# EasyEDA Pro project ProProject_单路无刷驱动版 BLDC_2023-12-23.epro, board 无刷V3.0_3-PCB1_5
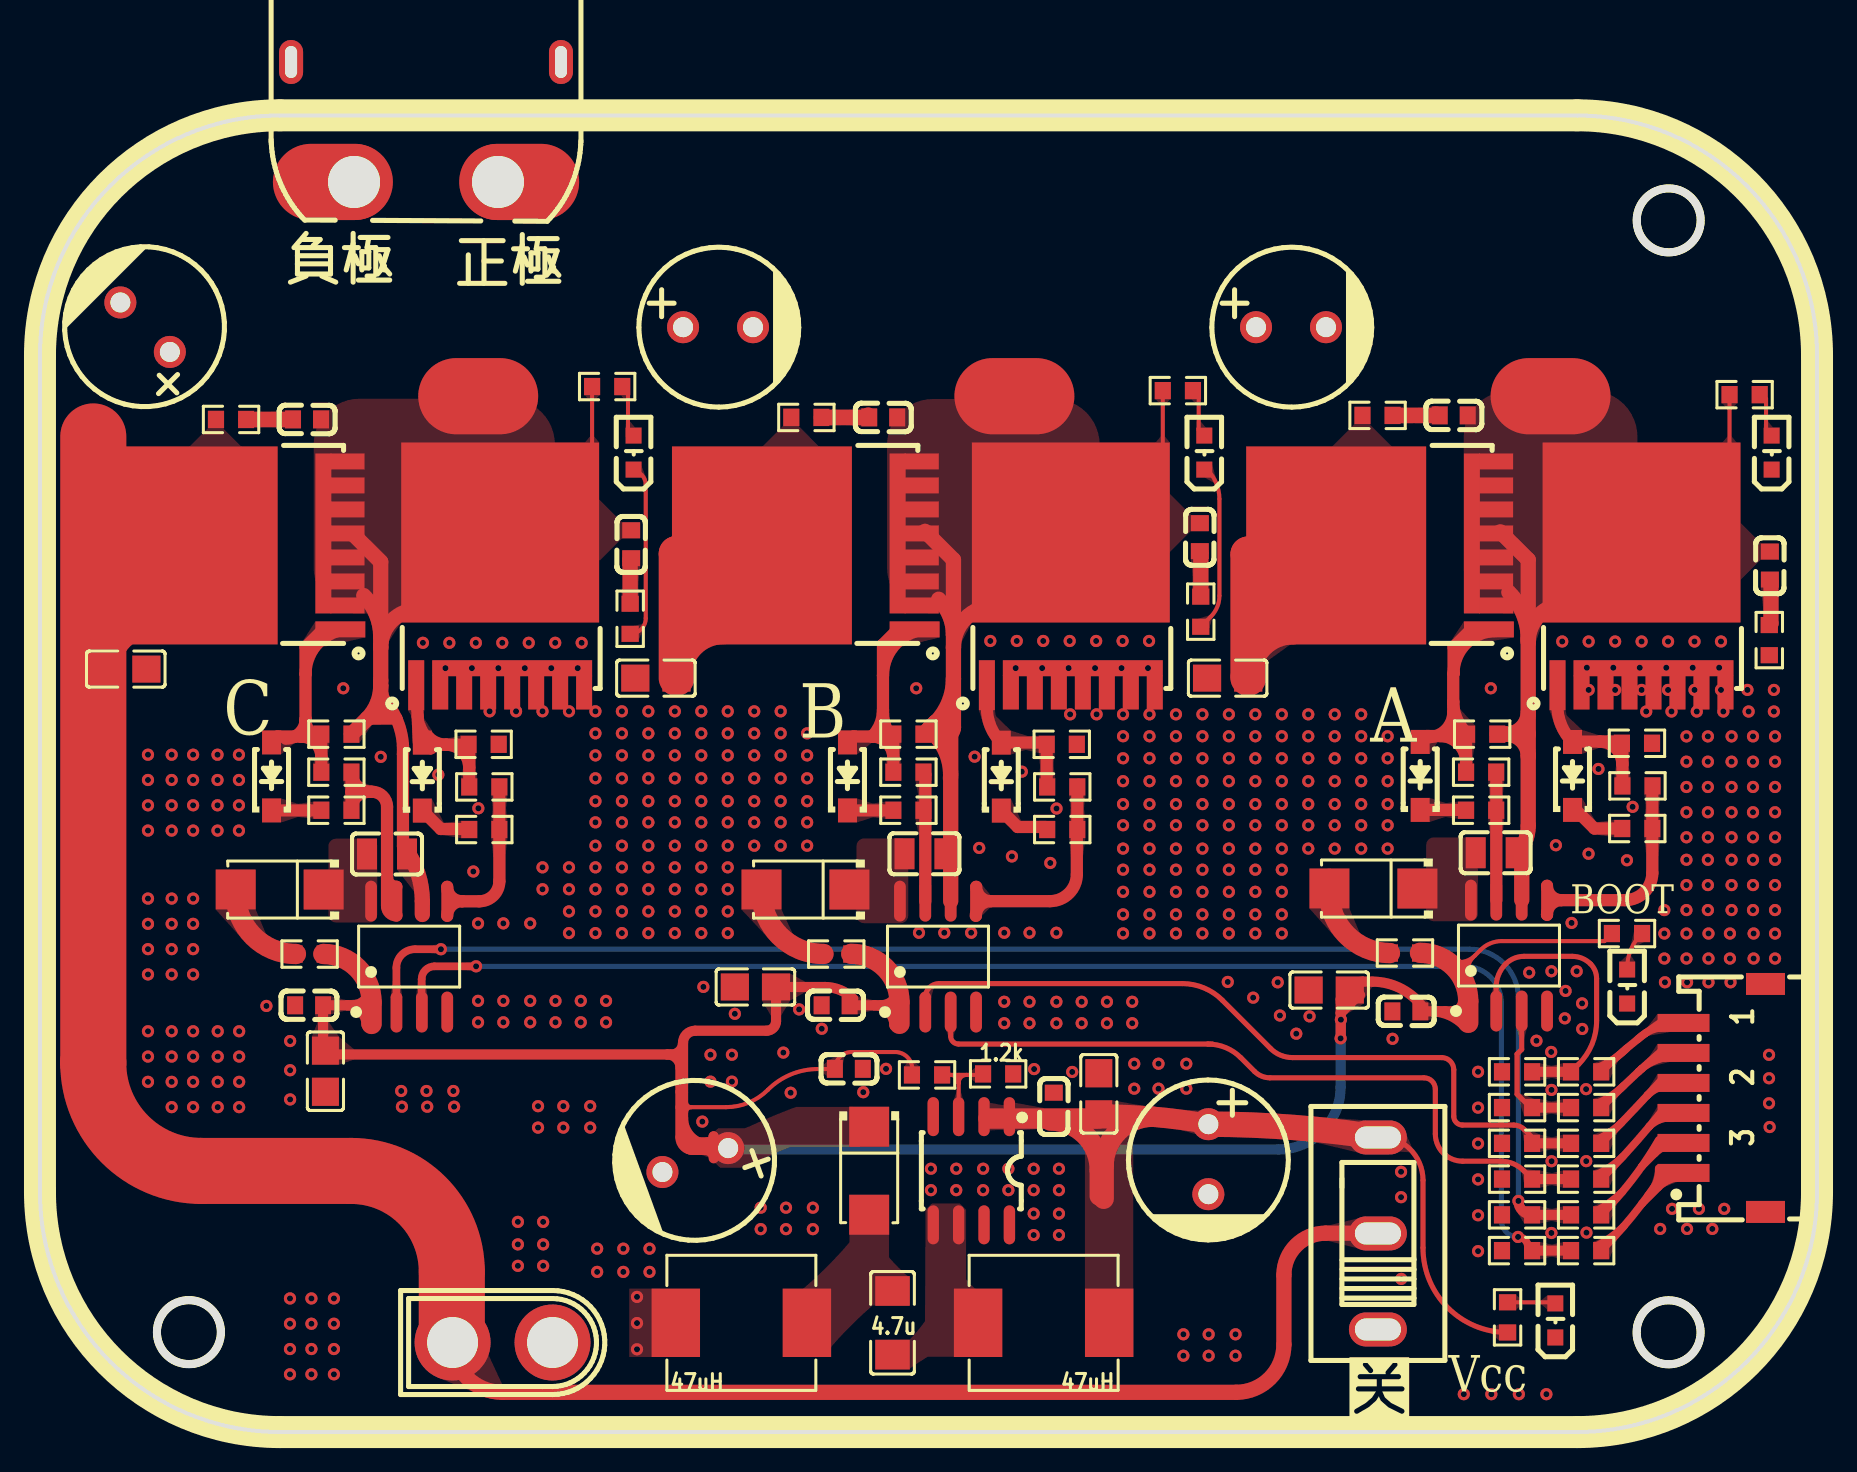
[diagram p2: board, top side]
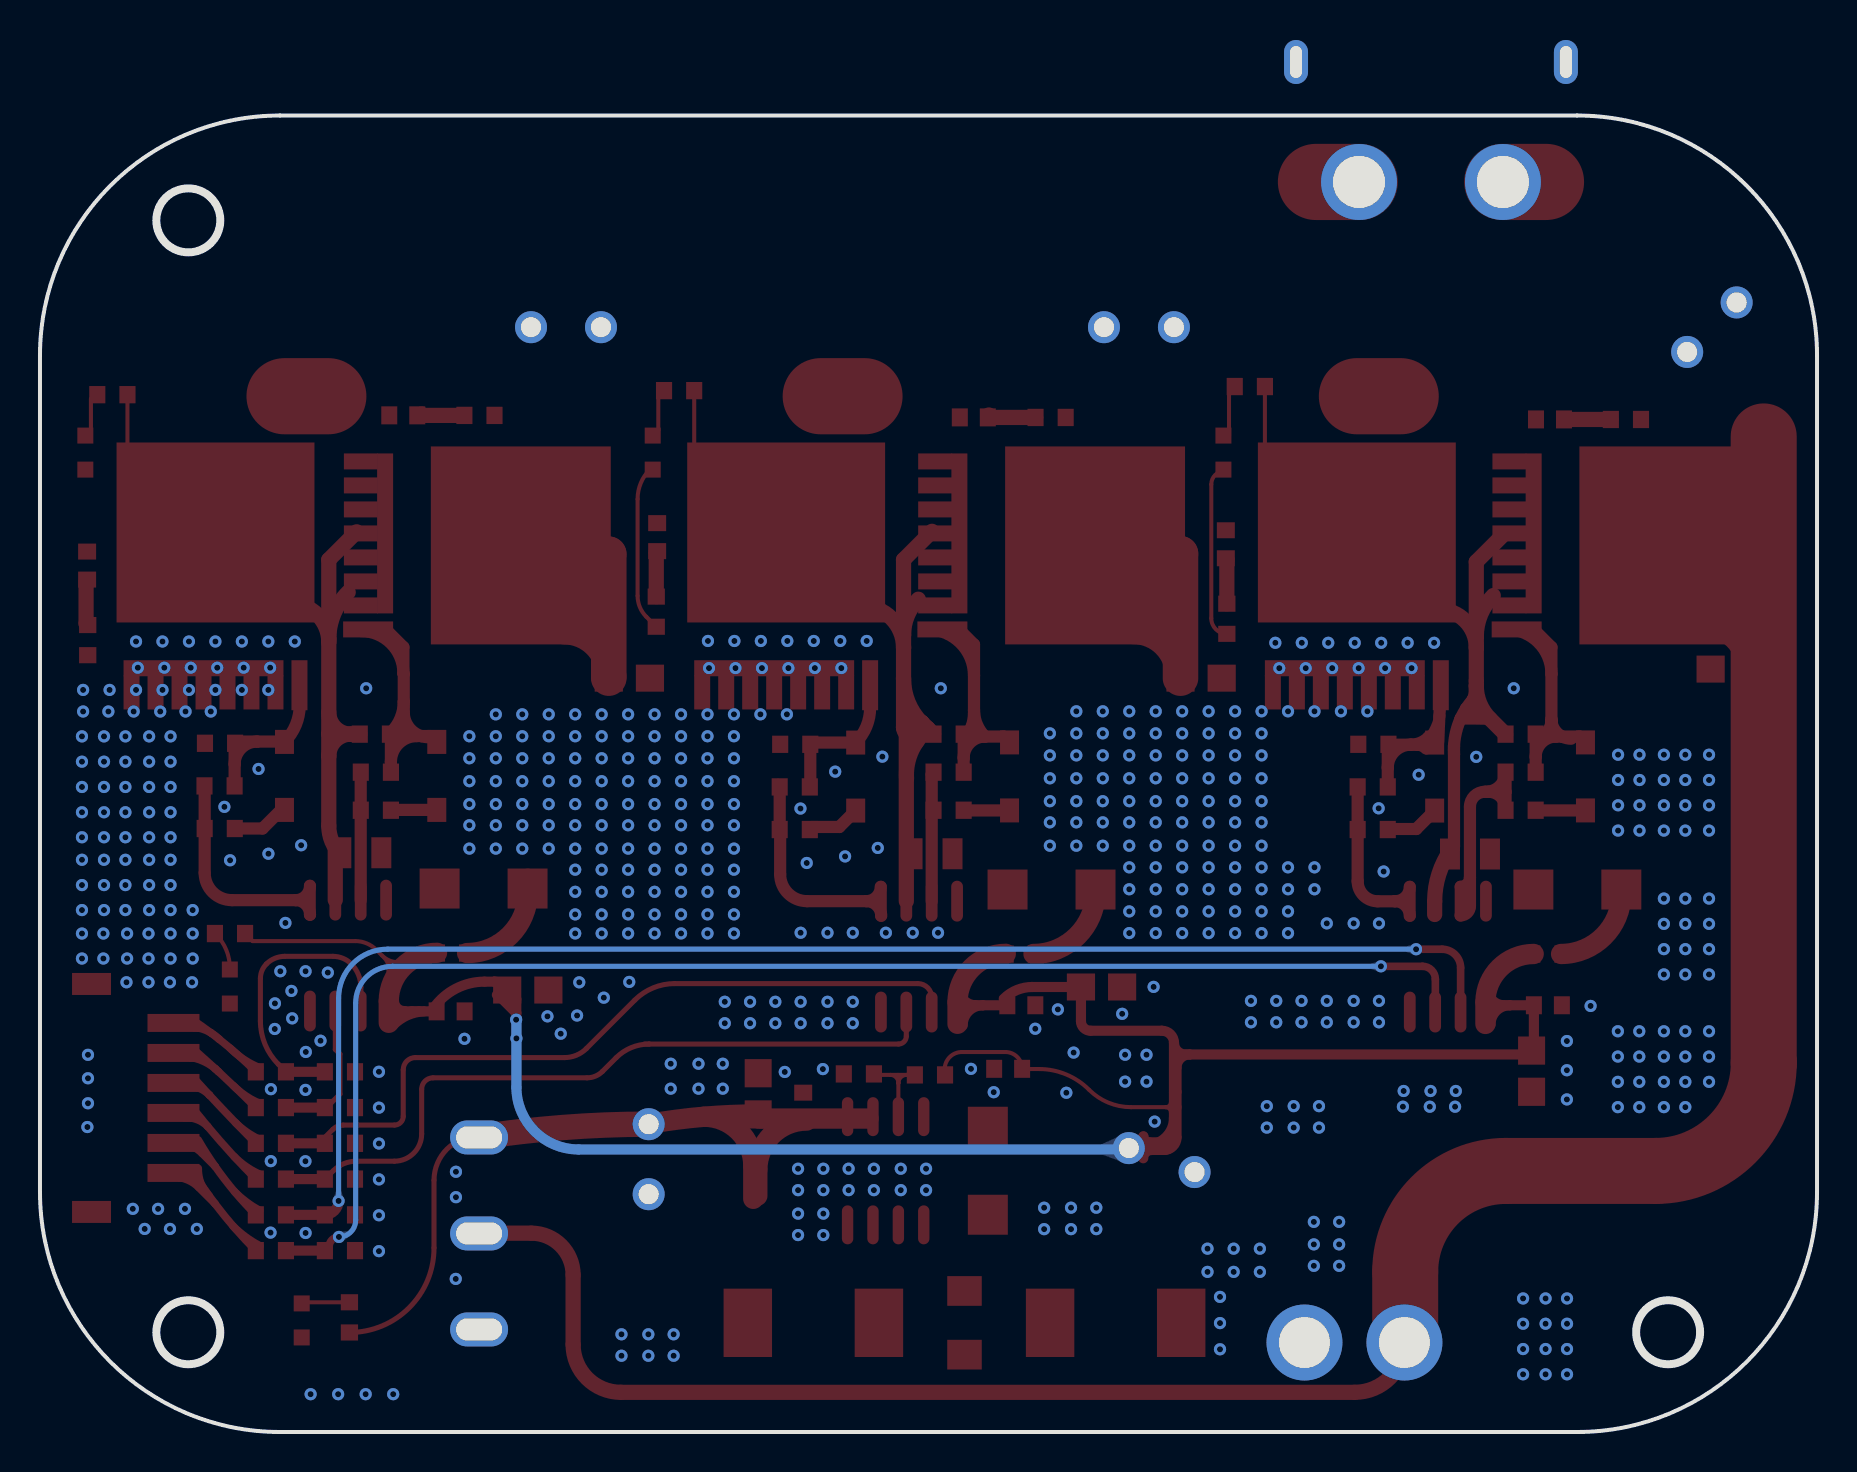
[diagram p3: board, bottom side, seen from below]

Outline 88.89 x 65.83 mm; copper layers: Top Layer, Bottom Layer. Coordinates in mm from the lower left corner of the outline.
Outline path: circle c7.45,4.99 r1.6 ; circle c81.48,60.58 r1.6 ; circle c81.48,4.99 r1.6 ; 0,53.83 0,12 arc(3.51,3.51) 12,0 76.89,0 arc(85.38,3.51) 88.89,12 88.89,53.83 arc(85.38,62.31) 76.89,65.83 12,65.83 arc(3.51,62.31) 0,53.83
Stack: Top Layer 0.035mm / Dielectric1 1.51mm FR4 er 4.5 / Bottom Layer 0.035mm

## Design rules (mm)
template: 用户自定义配置
spacing safeClearance (default): track to track 0.152, other pairs 0.152 to 0.3
track width trackWidth (default): min 0.127, default 0.254, max 4
differential pair differentialPair (default): width min 0.127, default 0.254, max 2.54; gap min 0.152, default 0.152
via viaSize (default): diameter min 0.5, default 0.61, max 10; hole min 0.3, default 0.305, max 5.999
pour e292 uses 8mil
pour e1048 uses 地-发散自适应8
pour e1738 uses copperRegion1
pour e6104 uses copperRegion1

## Placement (name value [footprint] x y rotation side)
C4  220uF  [CAP-TH_BD8.0-P3.50-D0.6-FD]  33.92 55.24 0 top
C5  220uF  [CAP-TH_BD8.0-P3.50-D0.6-FD]  5.26 55.24 135 top
C6  220uF  [CAP-TH_BD8.0-P3.50-D0.6-FD]  62.58 55.24 0 top
C8  2.2uF  [C0805]  30.81 37.7 0 top
C10  1uF  [C0805#2]  73.82 28.96 180 top
C11  10uF  [C0805]  64.49 22.1 0 top
C12  100nF  [C0603_1]  68.35 21.03 0 top
C14  220uF  [CAP-TH_BD8.0-P3.50-D0.6-FD]  58.45 13.64 270 top
C15  22uF  [C0805]  52.97 16.91 270 top
C16  1uF  [C0603]  50.71 16.27 270 top
C17  4.7uF  [C1206]  42.65 5.46 90 top
C18  220uF  [CAP-TH_BD8.0-P3.50-D0.6-FD]  32.78 13.6 200 top
C19  100nF  [C0603_1]  40.46 18.16 180 top
C20  2.2uF  [C0805]  59.41 37.7 0 top
C22  1uF  [C0805#2]  45.25 28.91 180 top
C23  10uF  [C0805]  35.79 22.25 0 top
C25  100nF  [C0603_1]  39.8 21.34 0 top
C27  2.2uF  [C0805]  4.29 38.15 180 top
C29  1uF  [C0805#2]  18.36 28.9 180 top
C39  10uF  [C0805]  14.28 18.04 90 top
C40  100nF  [C0603_1]  13.46 21.34 0 top
C47  2.2nF  [C0603]  70.72 50.84 180 top
C48  2.2nF  [C0603]  86.54 43.32 90 top
C49  2.2nF  [C0603]  42.18 50.73 180 top
C50  2.2nF  [C0603]  58.02 44.75 90 top
C51  2.2nF  [C0603]  13.36 50.63 180 top
C52  2.2nF  [C0603]  29.57 44.39 90 top
CN3  KH-ZH1.5WF-06A  [CONN-SMD_KH-ZH1.5WF-06A]  84.27 16.7 90 top
CN4  XT30U-M  [CONN-TH_XT30U-M]  23.14 4.47 0 top
CN5  XT60PW-M  [CONN-TH_XT60PW-M]  19.31 65.5 270 top
D1  B5819W SL  [SOD-123_L2.7-W1.6-LS3.7-RD-1]  69.05 32.81 90 top
D5  SS210  [SMA_L4.3-W2.6-LS5.2-RD]  66.7 27.18 180 top
D6  B5819W SL  [SOD-123_L2.7-W1.6-LS3.7-RD-1]  76.66 32.81 90 top
D8  B5819W SL  [SOD-123_L2.7-W1.6-LS3.7-RD-1]  40.39 32.78 90 top
D10  SS210  [SMA_L4.3-W2.6-LS5.2-RD]  38.29 27.12 180 top
D11  B5819W SL  [SOD-123_L2.7-W1.6-LS3.7-RD-1]  48.09 32.77 90 top
D13  B5819W SL  [SOD-123_L2.7-W1.6-LS3.7-RD-1]  11.58 32.78 90 top
D15  SS210  [SMA_L4.3-W2.6-LS5.2-RD]  11.99 27.12 180 top
D16  B5819W SL  [SOD-123_L2.7-W1.6-LS3.7-RD-1]  19.13 32.77 90 top
D18  SS210  [SMA_L4.3-W2.6-LS5.2-RD]  41.48 13.06 270 top
L1  47uH  [IND-SMD_L7.3-W6.6]  50.21 5.46 0 top
L2  47uH  [IND-SMD_L7.3-W6.6]  35.09 5.46 180 top
LED2  KT-0603R  [LED0603-R-RD]  79.4 22.28 90 top
LED4  KT-0603R  [LED0603-R-RD]  75.8 5.58 90 top
LED5  KT-0603R  [LED0603-R-RD]  86.63 48.97 90 top
LED6  KT-0603R  [LED0603-R-RD]  58.24 48.97 90 top
LED7  KT-0603R  [LED0603-R-RD]  29.69 48.97 90 top
NOREF  -  [Pad_e2409]  14.65 62.51 90 top
NOREF#2  -  [Pad_e2408]  23.97 62.51 90 top
NOREF#3  -  [Pad_e56]  48.74 51.79 270 top
NOREF#4  -  [Pad_e62]  21.92 51.79 90 top
NOREF#5  -  [Pad_e61]  75.57 51.79 90 top
Q1  HYG011N04LS1TA  [PG-HSOF-8_L10.4-W9.9-P1.2-LS11.7-TL-1]  68.84 44.33 180 top
Q2  HYG011N04LS1TA  [PG-HSOF-8_L10.4-W9.9-P1.2-LS11.7-TL-1]  80.11 40.98 90 top
Q3  HYG011N04LS1TA  [PG-HSOF-8_L10.4-W9.9-P1.2-LS11.7-TL-1]  40.11 44.33 180 top
Q4  HYG011N04LS1TA  [PG-HSOF-8_L10.4-W9.9-P1.2-LS11.7-TL-1]  51.57 40.98 90 top
Q5  HYG011N04LS1TA  [PG-HSOF-8_L10.4-W9.9-P1.2-LS11.7-TL-1]  11.39 44.33 180 top
Q6  HYG011N04LS1TA  [PG-HSOF-8_L10.4-W9.9-P1.2-LS11.7-TL-1]  23.02 40.98 90 top
R1  4.7Ω  [R0603]  72.09 31.09 180 top
R2  0603WAF220KT5E  [R0603]  66.91 50.83 180 top
R4  0603WAF100JT5E  [R0603]  72.09 32.99 180 top
R5  0603WAF220KT5E  [R0603]  68.28 23.95 180 top
R6  10kΩ  [R0603]  72.14 34.89 180 top
R7  100Ω  [R0603]  77.34 18.01 180 top
R8  4.7Ω  [R0603]  79.9 30.18 180 top
R9  0603WAF100JT5E  [R0603]  79.91 32.31 180 top
R10  10kΩ  [R0603]  79.89 34.44 180 top
R11  100Ω  [R0603]  77.34 16.22 180 top
R12  100Ω  [R0603]  77.34 14.43 180 top
R13  100Ω  [R0603]  77.34 12.65 180 top
R14  100Ω  [R0603]  77.34 10.86 180 top
R15  100Ω  [R0603]  77.34 9.07 180 top
R16  10kΩ  [R0603]  73.89 18.01 0 top
R17  10kΩ  [R0603]  73.89 16.22 0 top
R18  0603WAF220KT5E  [R0603]  86.51 39.6 90 top
R19  4.7Ω  [R0603]  43.44 31.09 180 top
R20  10kΩ  [R0603]  73.89 14.43 0 top
R21  10kΩ  [R0603]  73.89 12.65 0 top
R22  10kΩ  [R0603]  73.89 10.86 0 top
R23  10kΩ  [R0603]  73.89 9.07 0 top
R24  0603WAF220KT5E  [R0603]  38.34 50.73 180 top
R26  0603WAF1201T5E  [R0603]  47.93 17.91 180 top
R27  10k  [R0603]  79.39 24.92 0 top
R28  0603WAF100JT5E  [R0603]  43.44 32.99 180 top
R29  0603WAF220KT5E  [R0603]  39.83 23.9 180 top
R30  10k  [R0603]  44.37 17.86 0 top
R31  10kΩ  [R0603]  43.44 34.89 180 top
R32  4.7Ω  [R0603]  51.14 30.13 180 top
R33  0603WAF100JT5E  [R0603]  51.14 32.26 180 top
R34  10kΩ  [R0603]  51.11 34.39 180 top
R36  0603WAF220KT5E  [R0603]  58.07 41.02 90 top
R37  4.7Ω  [R0603]  14.83 31.09 180 top
R38  0603WAF220KT5E  [R0603]  9.56 50.63 180 top
R39  0603WAF100JT5E  [R0603]  14.83 32.99 180 top
R40  0603WAF220KT5E  [R0603]  13.49 23.9 180 top
R41  10kΩ  [R0603]  14.83 34.89 180 top
R42  4.7Ω  [R0603]  22.23 30.13 180 top
R43  0603WAF100JT5E  [R0603]  22.23 32.26 180 top
R44  10k  [R0603]  73.42 5.73 270 top
R45  10k  [R0603]  85.27 51.87 180 top
R46  10kΩ  [R0603]  22.19 34.39 180 top
R47  10k  [R0603]  56.92 52.07 180 top
R48  0603WAF220KT5E  [R0603]  29.52 40.66 90 top
R49  10k  [R0603]  28.37 52.28 180 top
SW1  SS12D10G4 071  [SW-TH_SHOU-HAN_SS12D10G4]  66.93 9.93 90 top
U2  XL6007E1  [SOIC-8_L5.0-W4.0-P1.27-LS6.0-BL]  46.59 13.06 180 top
U7  EG3112  [SOIC-8_L4.9-W3.9-P1.27-LS6.0-BL]  73.49 23.82 0 top
U10  EG3112  [SOIC-8_L4.9-W3.9-P1.27-LS6.0-BL]  44.92 23.77 0 top
U11  EG3112  [SOIC-8_L4.9-W3.9-P1.27-LS6.0-BL]  18.47 23.77 0 top

## Footprints (pads in the part's own frame, mm; a bottom-side part is the same pattern mirrored in y, then rotated)
C0603
  rect 0.8x0.9 smd: 1(-0.7,0) 2(0.7,0)
C0603_1
  rect 0.8x0.9 smd: 1(-0.7,0) 2(0.7,0)
C0805
  rect 1.409x1.351 smd: 1(-1.028,0) 2(1.031,0)
C0805#2
  rect 1x1.55 smd: 1(0,0) 2(2,0)
C1206
  rect 1.485x1.728 smd: 1(-1.593,0) 2(1.593,0)
CAP-TH_BD8.0-P3.50-D0.6-FD
  round 1.6 hole 1: 1(-1.75,0) 2(1.75,0)
CONN-SMD_KH-ZH1.5WF-06A
  rect 0.9x2.6 smd: 1(-3.75,2.05) 2(-2.25,2.05) 3(-0.75,2.05) 4(0.75,2.05) 5(2.25,2.05) 6(3.75,2.05)
  rect 1.1x1.95 smd: 7(5.7,-2.05) 8(-5.7,-2.05)
CONN-TH_XT30U-M
  round 3.8 hole 2.54: 1(-2.5,0) 2(2.5,0)
CONN-TH_XT60PW-M
  round 3.8 hole 2.6: 1(3,-3.6) 2(3,3.6)
  oval 2.2x1.2 hole 1.6x0.6: 3(-3,6.75) 4(-3,-6.75)
IND-SMD_L7.3-W6.6
  rect 2.423x3.419 smd: 1(3.279,0) 2(-3.279,0)
LED0603-R-RD
  rect 0.8x0.8 smd: 1(0.851,0) 2(-0.851,0)
Pad_e56
  oval 3.81x6 smd: 1(0,0)
Pad_e61
  oval 3.81x6 smd: 2(0,0)
Pad_e62
  oval 3.81x6 smd: 3(0,0)
Pad_e2408
  oval 3.81x6 smd: 3(0,0)
Pad_e2409
  oval 3.81x6 smd: 3(0,0)
PG-HSOF-8_L10.4-W9.9-P1.2-LS11.7-TL-1
  rect 2.5x0.8 smd: 1(-3.638,4.2)
  rect 1.7x0.8 smd: 2(-4,3) 3(-4,1.8) 4(-4,0.6) 5(-4,-0.6) 6(-4,-1.8) 7(-4,-3) 8(-4,-4.2)
  rect 0.8x8 smd: 8(-2.788,-0.6)
  rect 9x9.9 smd: 9(4,0)
R0603
  rect 0.807x0.864 smd: 1(-0.754,0) 2(0.754,0)
SMA_L4.3-W2.6-LS5.2-RD
  rect 2x2 smd: 1(-2.2,0) 2(2.2,0)
SOD-123_L2.7-W1.6-LS3.7-RD-1
  rect 1.2x0.95 smd: 1(-1.7,0) 2(1.7,0)
SOIC-8_L4.9-W3.9-P1.27-LS6.0-BL
  oval 0.588x2.045 smd: 1(-1.905,-2.772) 2(-0.635,-2.772) 3(0.635,-2.772) 4(1.905,-2.772) 5(1.905,2.772) 6(0.635,2.772) 7(-0.635,2.772) 8(-1.905,2.772)
SOIC-8_L5.0-W4.0-P1.27-LS6.0-BL
  oval 0.569x1.95 smd: 1(-1.905,-2.705) 2(-0.635,-2.705) 3(0.635,-2.705) 4(1.905,-2.705) 5(1.905,2.705) 6(0.635,2.705) 7(-0.635,2.705) 8(-1.905,2.705)
SW-TH_SHOU-HAN_SS12D10G4
  oval 1.7x2.9 hole 1.1x2.3: 1(-4.8,0) 2(0,0) 3(4.8,0)

## Nets
As in the schematic, except:
GND: C4.2 C5.2 C6.2 C8.1 C11.1 C12.1 C14.2 C15.1 C16.1 C18.2 C19.1 C20.1 C23.1 C25.1 C27.1 C39.1 C40.1 CN3.7 CN3.8 CN4.2 CN5.1 L2.1 LED2.2 LED4.2 LED5.2 LED6.2 LED7.2 NOREF.3 Q2.2 Q2.3 Q2.4 Q2.5 Q2.6 Q2.7 Q2.8 Q4.2 Q4.3 Q4.4 Q4.5 Q4.6 Q4.7 Q4.8 Q6.2 Q6.3 Q6.4 Q6.5 Q6.6 Q6.7 Q6.8 R10.1 R16.1 R17.1 R18.1 R20.1 R21.1 R22.1 R23.1 R26.1 R34.1 R36.1 R46.1 R48.1 U2.7 U2.8 U7.4 U10.4 U11.4
VCC: C14.1 C15.2 C16.2 L1.1 R44.2 SW1.3 U2.1 U2.2
BAT: C4.1 C5.1 C6.1 C8.2 C20.2 C27.2 CN4.1 CN5.2 NOREF#2.3 Q1.9 Q3.9 Q5.9 R2.2 R24.2 R38.2 SW1.2
OUT1: C10.1 C47.1 C48.2 NOREF#5.2 Q1.2 Q1.3 Q1.4 Q1.5 Q1.6 Q1.7 Q1.8 Q2.9 R6.1 R45.2 U7.6
OUT2: C22.1 C49.1 C50.2 NOREF#3.1 Q3.2 Q3.3 Q3.4 Q3.5 Q3.6 Q3.7 Q3.8 Q4.9 R31.1 R47.2 U10.6
OUT3: C29.1 C51.1 C52.2 NOREF#4.3 Q5.2 Q5.3 Q5.4 Q5.5 Q5.6 Q5.7 Q5.8 Q6.9 R41.1 R49.2 U11.6
$2N2328: D11.2 Q4.1 R33.2 R34.2
$2N2329: D8.2 Q3.1 R28.2 R31.2
$2N2348: D16.2 Q6.1 R43.2 R46.2
$2N2349: D13.2 Q5.1 R39.2 R41.2

Pads without a net: CN5 3 4; SW1 1; U2 4

## Via types
v1: diameter 0.61, hole 0.305, Top Layer to Bottom Layer, 558 vias

## Routing (per net, layer and track width the routed paths; a pad name or vN(x,y) marks a point on that pad's centre or on a via; arc(x,y) is an arc through that point)
GND: length 17.3
  Top Layer w0.203: R36.1 58.57,40.77 arc(58.89,41.25) 59,41.81 59,46.65 arc(58.84,47.45) 58.39,48.13 ; 29.63,48.06 arc(30.1,47.86) 30.3,47.38 30.3,40.69 arc(30.07,40.14) R48.1
  vias: v1(5.4,33.87) v1(5.4,32.6) v1(5.4,31.34) v1(5.4,30.07) v1(5.4,26.67) v1(5.4,25.41) v1(5.4,24.14) v1(5.4,22.88) v1(5.4,20.04) v1(5.4,18.77) v1(5.4,17.51) v1(6.59,33.87) v1(6.59,32.6) v1(6.59,31.34) v1(6.59,30.07) v1(6.59,26.67) v1(6.59,25.41) v1(6.59,24.14) v1(6.59,22.88) v1(6.59,20.04) v1(6.59,18.77) v1(6.59,17.51) v1(6.59,16.24) v1(7.66,33.87) v1(7.66,32.6) v1(7.66,31.34) v1(7.66,30.07) v1(7.66,26.67) v1(7.66,25.41) v1(7.66,24.14) v1(7.66,22.88) v1(7.66,20.04) v1(7.66,18.77) v1(7.66,17.51) v1(7.66,16.24) v1(8.88,33.87) v1(8.88,32.6) v1(8.88,31.34) v1(8.88,30.07) v1(8.89,20.04) v1(8.89,18.77) v1(8.89,17.51) v1(8.89,16.24) v1(9.95,33.87) v1(9.95,32.6) v1(9.95,31.34) v1(9.95,30.07) v1(9.96,20.04) v1(9.96,18.77) v1(9.96,17.51) v1(9.96,16.24) v1(11.33,21.3) v1(12.51,19.55) v1(12.51,18.09) v1(12.51,16.63) v1(12.51,6.68) v1(12.51,5.41) v1(12.51,4.15) v1(12.51,2.88) v1(13.58,6.68) v1(13.58,5.41) v1(13.58,4.15) v1(13.58,2.88) v1(14.7,6.68) v1(14.7,5.41) v1(14.7,4.15) v1(14.7,2.88) v1(15.17,37.19) v1(17.05,33.76) v1(18.07,17.05) v1(18.11,16.27) v1(19.16,39.46) v1(19.33,17.05) v1(19.37,16.27) v1(19.93,32.86) v1(20.28,38.2) v1(20.48,39.46) v1(20.68,17.05) v1(20.72,16.27) v1(21.61,38.2) v1(21.68,28.03) v1(21.8,39.46) v1(21.93,31.19) v1(21.91,25.43) v1(21.91,21.56) v1(21.91,20.49) v1(22.49,36.04) v1(22.93,38.2) v1(23.13,39.46) v1(23.18,25.43) v1(23.18,21.56) v1(23.18,20.49) v1(23.82,36.04) v1(23.91,10.51) v1(23.91,9.38) v1(23.91,8.31) v1(24.25,38.2) v1(24.45,39.46) v1(24.52,25.43) v1(24.52,21.56) v1(24.52,20.49) v1(24.91,16.29) v1(24.91,15.22) v1(25.14,36.04) v1(25.14,28.23) v1(25.14,27.14) v1(25.17,10.51) v1(25.17,9.38) v1(25.17,8.31) v1(25.58,38.2) v1(25.77,39.46) v1(25.79,21.56) v1(25.79,20.49) v1(26.18,16.29) v1(26.18,15.22) v1(26.46,36.04) v1(26.46,28.23) v1(26.46,27.14) v1(26.46,26.03) v1(26.46,24.95) v1(26.9,38.2) v1(27.1,39.46) v1(27.05,21.56) v1(27.05,20.49) v1(27.52,16.29) v1(27.52,15.22) v1(27.79,36.04) v1(27.79,34.93) v1(27.79,33.83) v1(27.79,32.69) v1(27.79,31.54) v1(27.79,30.48) v1(27.79,29.32) v1(27.79,28.23) v1(27.79,27.14) v1(27.79,26.03) v1(27.79,24.95) v1(27.87,9.17) v1(27.87,8.01) v1(28.32,21.56) v1(28.32,20.49) v1(29.11,36.04) v1(29.11,34.93) v1(29.11,33.83) v1(29.11,32.69) v1(29.11,31.54) v1(29.11,30.48) v1(29.11,29.32) v1(29.11,28.23) v1(29.11,27.14) v1(29.11,26.03) v1(29.11,24.95) v1(29.18,9.17) v1(29.18,8.01) v1(29.87,6.76) v1(29.87,5.45) v1(29.87,4.14) v1(30.43,36.04) v1(30.43,34.93) v1(30.43,33.83) v1(30.43,32.69) v1(30.43,31.54) v1(30.43,30.48) v1(30.43,29.32) v1(30.43,28.23) v1(30.43,27.14) v1(30.43,26.03) v1(30.43,24.95) v1(30.49,9.17) v1(30.49,8.01) v1(31.76,36.04) v1(31.76,34.93) v1(31.76,33.83) v1(31.76,32.69) v1(31.76,31.54) v1(31.76,30.48) v1(31.76,29.32) v1(31.76,28.23) v1(31.76,27.14) v1(31.76,26.03) v1(31.76,24.95) v1(33.08,36.04) v1(33.08,34.93) v1(33.08,33.83) v1(33.08,32.69) v1(33.08,31.54) v1(33.08,30.48) v1(33.08,29.32) v1(33.08,28.23) v1(33.08,27.14) v1(33.08,26.03) v1(33.08,24.95) v1(33.19,22.26) v1(33.13,15.52) v1(33.54,18.86) v1(33.54,17.52) v1(34.41,36.04) v1(34.41,34.93) v1(34.41,33.83) v1(34.41,32.69) v1(34.41,31.54) v1(34.41,30.48) v1(34.41,29.32) v1(34.41,28.23) v1(34.41,27.14) v1(34.41,26.03) v1(34.41,24.95) v1(34.61,18.86) v1(34.61,17.52) v1(34.76,20.91) v1(35.73,36.04) v1(35.73,34.93) v1(35.73,33.83) v1(35.73,32.69) v1(35.73,31.54) v1(35.73,30.48) v1(35.73,29.32) v1(36.05,11.22) v1(36.05,10.14) v1(37.05,36.04) v1(37.05,34.93) v1(37.05,33.83) v1(37.05,32.69) v1(37.05,31.54) v1(37.05,30.48) v1(37.05,29.32) v1(37.19,18.97) v1(37.32,11.22) v1(37.32,10.14) v1(37.55,16.96) v1(37.98,21.13) v1(38.38,34.93) v1(38.38,33.83) v1(38.38,32.69) v1(38.38,31.54) v1(38.38,30.48) v1(38.38,29.32) v1(38.66,11.22) v1(38.66,10.14) v1(39.11,20.16) v1(41.18,16.99) v1(42.32,18.16) v1(43.83,37.19) v1(43.97,24.96) v1(44.57,13.16) v1(44.57,12.09) v1(45.24,24.96) v1(45.83,13.16) v1(45.83,12.09) v1(46.58,24.96) v1(46.76,33.77) v1(46.98,29.21) v1(47.18,13.16) v1(47.18,12.09) v1(47.54,39.55) v1(48.24,24.96) v1(48.24,21.51) v1(48.24,20.44) v1(48.44,13.16) v1(48.44,12.09) v1(48.62,28.78) v1(48.86,39.55) v1(48.81,38.2) v1(49.11,33.02) v1(49.5,24.96) v1(49.5,21.51) v1(49.5,20.44) v1(49.73,18.15) v1(49.71,13.16) v1(49.71,12.09) v1(49.71,10.92) v1(49.71,9.85) v1(50.19,39.55) v1(50.13,38.2) v1(50.54,28.45) v1(50.85,31.18) v1(50.84,24.96) v1(50.84,21.51) v1(50.84,20.44) v1(50.97,13.16) v1(50.97,12.09) v1(50.97,10.92) v1(50.97,9.85) v1(51.46,38.2) v1(51.51,39.55) v1(51.53,35.89) v1(51.64,18) v1(52.11,21.51) v1(52.11,20.44) v1(52.78,38.2) v1(52.83,39.55) v1(52.86,35.89) v1(53.37,21.51) v1(53.37,20.44) v1(54.1,38.2) v1(54.16,39.55) v1(54.18,35.89) v1(54.18,34.79) v1(54.18,33.69) v1(54.18,32.54) v1(54.18,31.4) v1(54.18,30.34) v1(54.18,29.17) v1(54.18,28.12) v1(54.18,27.01) v1(54.18,25.88) v1(54.18,24.93) v1(54.64,21.51) v1(54.64,20.44) v1(54.74,18.41) v1(54.74,17.17) v1(55.48,39.55) v1(55.43,38.2) v1(55.5,35.89) v1(55.5,34.79) v1(55.5,33.69) v1(55.5,32.54) v1(55.5,31.4) v1(55.5,30.34) v1(55.5,29.17) v1(55.5,28.12) v1(55.5,27.01) v1(55.5,25.88) v1(55.5,24.93) v1(55.95,18.41) v1(55.95,17.17) v1(56.83,35.89) v1(56.83,34.79) v1(56.83,33.69) v1(56.83,32.54) v1(56.83,31.4) v1(56.83,30.34) v1(56.83,29.17) v1(56.83,28.12) v1(56.83,27.01) v1(56.83,25.88) v1(56.83,24.93) v1(57.2,4.89) v1(57.2,3.81) v1(57.34,18.41) v1(57.34,17.17) v1(58.15,35.89) v1(58.15,34.79) v1(58.15,33.69) v1(58.15,32.54) v1(58.15,31.4) v1(58.15,30.34) v1(58.15,29.17) v1(58.15,28.12) v1(58.15,27.01) v1(58.15,25.88) v1(58.15,24.93) v1(58.46,4.89) v1(58.46,3.81) v1(59.47,35.89) v1(59.47,34.79) v1(59.47,33.69) v1(59.47,32.54) v1(59.47,31.4) v1(59.47,30.34) v1(59.47,29.17) v1(59.47,28.12) v1(59.47,27.01) v1(59.47,25.88) v1(59.47,24.93) v1(59.42,22.51) v1(59.81,4.89) v1(59.81,3.81) v1(60.69,21.72) v1(60.8,35.89) v1(60.8,34.79) v1(60.8,33.69) v1(60.8,32.54) v1(60.8,31.4) v1(60.8,30.34) v1(60.8,29.17) v1(60.8,28.12) v1(60.8,27.01) v1(60.8,25.88) v1(60.8,24.93) v1(61.92,22.49) v1(62.03,20.83) v1(62.12,35.89) v1(62.12,34.79) v1(62.12,33.69) v1(62.12,32.54) v1(62.12,31.4) v1(62.12,30.34) v1(62.12,29.17) v1(62.12,28.12) v1(62.12,27.01) v1(62.12,25.88) v1(62.12,24.93) v1(62.84,19.92) v1(63.45,35.89) v1(63.45,34.79) v1(63.45,33.69) v1(63.45,32.54) v1(63.45,31.4) v1(63.45,30.34) v1(63.45,29.17) v1(63.51,20.78) v1(64.77,35.89) v1(64.77,34.79) v1(64.77,33.69) v1(64.77,32.54) v1(64.77,31.4) v1(64.77,30.34) v1(64.77,29.17) v1(66.09,35.89) v1(66.09,34.79) v1(66.09,33.69) v1(66.09,32.54) v1(66.09,31.4) v1(66.09,30.34) v1(66.09,29.17) v1(67.42,34.79) v1(67.42,33.69) v1(67.42,32.54) v1(67.42,31.4) v1(67.42,30.34) v1(67.42,29.17) v1(67.66,19.66) v1(68.09,13.01) v1(68.09,11.74) v1(68.1,7.66) v1(71.23,1.89) v1(71.94,18.01) v1(71.94,16.22) v1(71.94,14.43) v1(71.94,12.63) v1(71.94,10.84) v1(71.94,9.04) v1(72.58,37.19) v1(72.6,1.89) v1(73.98,1.89) v1(74.5,22.97) v1(74.86,19.56) v1(75.36,1.89) v1(75.6,19) v1(75.61,23.04) v1(75.61,17.11) v1(75.62,13.54) v1(75.61,9.95) v1(75.83,29.34) v1(76.15,39.53) v1(76.28,20.68) v1(76.32,22.05) v1(76.62,25.46) v1(76.87,23.04) v1(77.14,21.43) v1(77.15,20.15) v1(77.38,38.22) v1(77.34,17.14) v1(77.35,13.54) v1(77.36,9.97) v1(77.47,39.53) v1(77.47,37.11) v1(77.47,28.92) v1(77.96,33.15) v1(78.7,38.22) v1(78.8,39.53) v1(78.8,37.11) v1(79.39,28.59) v1(79.67,31.26) v1(80.03,38.22) v1(80.12,39.53) v1(80.12,37.11) v1(80.35,36.03) v1(81.05,10.15) v1(81.26,26.1) v1(81.26,24.93) v1(81.26,23.68) v1(81.29,22.49) v1(81.35,38.22) v1(81.44,39.53) v1(81.44,37.11) v1(81.61,36.03) v1(81.64,11.16) v1(82.36,34.78) v1(82.36,33.52) v1(82.36,32.25) v1(82.36,30.99) v1(82.36,29.74) v1(82.36,28.61) v1(82.36,27.35) v1(82.36,26.1) v1(82.36,24.93) v1(82.36,23.68) v1(82.39,22.49) v1(82.39,10.15) v1(82.68,38.22) v1(82.77,39.53) v1(82.77,37.11) v1(82.88,36.03) v1(82.99,11.16) v1(83.44,34.78) v1(83.44,33.52) v1(83.44,32.25) v1(83.44,30.99) v1(83.44,29.74) v1(83.44,28.61) v1(83.44,27.35) v1(83.44,26.1) v1(83.47,24.93) v1(83.47,23.68) v1(83.47,22.49) v1(83.66,10.15) v1(84,38.22) v1(84.09,39.53) v1(84.09,37.11) v1(84.21,36.03) v1(84.25,11.16) v1(84.54,24.93) v1(84.54,23.68) v1(84.57,22.49) v1(84.62,34.78) v1(84.62,33.52) v1(84.62,32.25) v1(84.62,30.99) v1(84.62,29.74) v1(84.62,28.61) v1(84.62,27.35) v1(84.62,26.1) v1(85.41,37.11) v1(85.47,36.03) v1(85.69,34.78) v1(85.69,33.52) v1(85.69,32.25) v1(85.69,30.99) v1(85.69,29.74) v1(85.69,28.61) v1(85.69,27.35) v1(85.69,26.1) v1(85.72,24.93) v1(85.72,23.68) v1(86.49,18.86) v1(86.49,17.69) v1(86.49,16.44) v1(86.52,15.25) v1(86.74,37.11) v1(86.74,36.03) v1(86.8,34.78) v1(86.8,33.52) v1(86.8,32.25) v1(86.8,30.99) v1(86.8,29.74) v1(86.8,28.61) v1(86.8,27.35) v1(86.8,26.1) v1(86.8,24.93) v1(86.8,23.68)
VCC: length 44
  Top Layer w0.254: 66.99,14.79 arc(68.54,14.14) 69.18,12.59 69.18,9.21 arc(70.42,6.22) R44.2
  Top Layer w1.016: 53.21,11.66 53.21,13.3 arc(53.93,15.04) 55.67,15.76 ; 53.01,11.81 53.01,13.11 arc(52.29,14.85) 50.55,15.57 ; 47.45,15.67 52.93,15.67 ; C15.2 arc(55.7,15.76) 58.42,15.41 ; 52.97,4.85 arc(53.01,4.74) 53.11,4.7
  Top Layer w1.27: C14.1 arc(62.77,15.22) 67.06,14.72
BAT: length 141
  Top Layer w0.762: 67.15,9.94 64.31,9.94 arc(62.84,9.33) 62.23,7.85 62.23,4.38 arc(61.53,2.68) 59.83,1.98 23.13,1.98 arc(21.37,2.71) CN4.1
  Top Layer w1.27: 31.97,37.79 arc(32.62,39.37) 34.2,40.03 ; 60.44,37.78 arc(61.1,39.36) 62.68,40.01
  Top Layer w1.778: 62.5,43.89 60.44,43.89 C20.2 ; 34.41,43.91 31.84,43.91 C8.2
  Top Layer w2.032: 3.02,38.15 arc(3.79,40) 5.63,40.76
  Top Layer w3.302: 2.67,49.78 2.67,18.47 arc(2.67,18.47) 2.66,18.46 arc(4.25,14.64) 8.07,13.05 15.56,13.05 arc(19.13,11.58) 20.6,8.02 20.6,4.31
BOOT: length 155.1
  Top Layer w0.203: 70.99,23.49 71.32,23.49 ; 70.99,23.49 71.29,23.47 71.32,23.49 ; 70.99,23.49 arc(71.42,23.58) 71.78,23.82 72.07,24.11 arc(72.55,24.43) 73.12,24.55 78.26,24.55 R27.1 ; 71.32,23.49 71.32,23.23 arc(71.35,23.06) 71.45,22.91 ; 43.64,18.04 43.64,18.14 arc(43.39,18.75) 42.77,19 40.6,19 arc(40.01,18.75) C19.2 ; 71.45,22.91 71.45,21.55 ; 71.45,22.91 71.45,23.15 arc(71.51,23.46) 71.68,23.73 ; 32.04,17 32.15,17 32.17,16.99 ; 32.04,16.24 32.17,16.24 ; 71.45,23.49 71.45,23.04 ; 39.6,18.15 38.92,18.15 arc(37.56,17.88) 36.42,17.11 arc(35.45,16.47) 34.31,16.24 32.3,16.24 arc(32.21,16.2) 32.17,16.11 ; 32.58,16.25 arc(32.4,16.17) 32.32,15.99 ; 32.58,16.24 arc(32.4,16.32) 32.32,16.5
  Top Layer w0.508: 32.66,14.1 34.68,14.1 arc(34.7,14.1) 34.71,14.08 ; 32.66,14.1 arc(32.22,14.29) 32.04,14.73 32.04,18.22 arc(31.85,18.69) 31.39,18.88 ; 32.66,14.1 arc(32.31,14.25) 32.17,14.6 32.17,15.71 ; 65.55,22.13 65.79,22.36 arc(65.96,22.48) 66.17,22.52 66.65,22.52 arc(68.09,22.17) 69.2,21.2 ; 65.55,22.13 65.55,22.14 arc(65.55,22.16) 65.54,22.16 ; 65.55,22.13 65.07,21.65 65.07,20.95 ; 65.07,20.95 65.07,19.7 arc(65.07,19.69) v1(65.06,19.68) ; 65.07,20.95 65.93,21.81 arc(65.98,21.85) 66.04,21.86 ; 70.3,21.03 69.95,21.03 ; 70.3,21.03 70.27,21.01 ; 70.3,21.03 70.88,21.03 ; 69.95,21.03 C12.2 ; 69.95,21.03 arc(70.75,20.89) 71.45,20.46 ; 32.93,14.48 33.4,14.48 arc(33.61,14.57) 33.7,14.78 arc(33.52,14.34) 33.07,14.16 ; C25.2 41.73,21.34 ; 41.73,21.34 42.08,21.34 ; 41.73,21.34 arc(42.44,21.04) 42.74,20.33 ; 31.39,18.88 14.47,18.88 C39.2 ; 31.39,18.88 31.59,18.88 arc(32,19.05) 32.17,19.46 ; 15.37,21.34 16.53,21.34 arc(16.54,21.33) 16.55,21.32 ; 15.37,21.34 C40.2 14.16,19.46 arc(14.31,19.1) 14.66,18.96 ; 15.37,21.34 arc(16.05,21.05) 16.33,20.37 ; 70.88,21.03 71.38,21.03 arc(71.39,21.04) 71.4,21.05 ; 70.88,21.03 arc(71.28,20.87) 71.45,20.46 ; 70.88,21.03 arc(71.28,20.87) 71.45,20.46 ; 32.17,15.71 32.17,19.46 ; 32.17,15.71 arc(32.57,14.75) 33.53,14.35 ; 42.08,21.34 42.94,21.34 arc(42.96,21.33) 42.97,21.31 ; 42.08,21.34 arc(42.66,21.58) 42.9,22.16 ; 32.17,19.46 arc(32.34,19.89) 32.77,20.06 36.34,20.06 arc(36.68,20.2) 36.82,20.54 C23.2 39.26,22.25 arc(40.03,22.1) 40.68,21.66 ; 33.3,14.1 arc(33.59,13.98) 33.7,13.69 ; 69.69,21.03 arc(70.51,20.84) 71.21,20.36 ; 15.64,21.34 arc(16.24,21.58) 16.49,22.18 ; 70.67,21.05 arc(71.03,21.2) 71.18,21.56 ; 32.18,15.16 arc(32.48,14.44) 33.2,14.14
  Top Layer w1.016: 71.45,20.46 71.45,21.55 arc(70.74,23.25) 69.03,23.96 ; 16.59,20.4 16.59,21.49 arc(15.88,23.2) 14.17,23.9 ; 43,20.41 43,21.5 arc(42.29,23.2) 40.58,23.91
  Bottom Layer w0.508: 34.57,14.13 61.95,14.13 arc(64.15,15.04) 65.06,17.24 v1(65.06,19.68) 65.06,20.59 arc(65.06,20.62) 65.04,20.65
  vias: v1(65.08,20.62)
GPIO1: length 8.7
  Top Layer w0.381: 82.73,18.77 81.79,18.77 arc(80.9,18.61) 80.11,18.16 ; 80.11,18.16 arc(80.04,18.08) 79.96,18.01 ; 80.11,18.16 arc(80.04,18.08) 79.96,18.01 ; 80.11,18.16 arc(80.63,18.62) 81.15,19.08 ; 79.96,18.01 arc(79.02,17.13) R11.1 ; 79.22,17.32 arc(78.63,16.83) 77.95,16.45
GPIO2: length 7.3
  Top Layer w0.381: 81.67,15.72 81.57,15.72 arc(80.99,15.61) 80.51,15.28 ; 79.18,13.77 arc(78.58,13.27) 77.91,12.89 ; R13.1 arc(79.33,13.94) 80.51,15.28 ; 80.51,15.28 arc(80.78,15.61) 81.05,15.95
GPIO3: length 10.8
  Top Layer w0.381: 80.14,11.42 80.95,12.23 arc(81.53,12.61) 82.21,12.75 ; 80.14,11.42 arc(79.16,10.21) R15.1 ; 80.14,11.42 arc(80.72,12.22) 81.26,13.04 ; 79.24,10.31 arc(78.6,9.76) 77.89,9.31 ; 80.43,11.81 arc(80.85,12.44) 80.98,13.19
HI1: length 14.3
  Top Layer w0.254: 72.84,21.44 72.84,22.25 arc(72.97,22.87) 73.32,23.41 arc(73.74,23.69) 74.24,23.78 76.65,23.78 arc(77.15,23.69) 77.57,23.41 arc(77.79,23.07) 77.87,22.67 77.87,20.55 arc(77.64,19.38) 76.98,18.39 R7.2
  Top Layer w0.508: R16.2 76.51,18.01
HI2: length 37.9
  Top Layer w0.254: 74.71,14.67 74.24,15.14 arc(74.01,15.29) 73.73,15.35 71.16,15.35 arc(70.85,15.48) 70.72,15.79 70.72,18.12 arc(70.55,18.54) 70.12,18.72 62.65,18.72 arc(62.06,18.84) 61.56,19.17 59.14,21.6 arc(58.22,22.21) 57.14,22.42 44.98,22.42 arc(44.49,22.22) 44.29,21.73 U10.2
  Top Layer w0.508: 74.78,14.48 74.82,14.43 R12.2
HI3: length 72.9
  Top Layer w0.381: v1(20.06,24.14) 18.75,24.14 arc(18.1,23.87) 17.83,23.21 17.83,21.58 arc(17.83,21.58) 17.82,21.58
  Top Layer w0.508: 74.74,10.86 74.65,10.86 arc(74.16,11.06) v1(73.96,11.56) ; 74.74,10.86 74.7,10.9 ; 74.74,10.86 R14.2
  Bottom Layer w0.254: v1(73.96,11.56) 73.96,21.69 arc(73.24,23.43) 71.51,24.14 20.06,24.14 arc(20.06,24.14) v1(20.06,24.14)
HO1: length 6.2
  Top Layer w0.61: U7.7 72.85,32.77
HO2: length 6.5
  Top Layer w0.61: U10.7 44.29,32.88 arc(44.26,32.94) 44.2,32.97
HO3: length 13.4
  Top Layer w0.61: 16.43,32.01 15.58,32.01 ; 16.43,32.01 16.56,32.01 ; 16.43,32.01 arc(15.83,31.76) 15.58,31.17 ; 15.58,32.01 R39.1 arc(15.87,32.3) 16.56,32.01 ; 15.58,32.01 15.58,31.11 arc(15.58,31.11) 15.58,31.11 ; 16.56,32.01 16.62,32.01 arc(17.14,31.79) 17.36,31.27 17.36,27.73 ; 17.36,27.73 17.36,26.3 arc(17.5,25.97) 17.83,25.83 ; 17.36,27.73 arc(17.5,27.4) 17.83,27.26
LI1: length 7.1
  Top Layer w0.254: 74.55,16.23 73.89,16.89 73.89,18.9 74.12,19.13 U7.3
  Top Layer w0.381: 74.55,16.22 R17.2
  Top Layer w0.508: 76.51,16.23 76.5,16.22 R17.2
LI2: length 36.7
  Top Layer w0.254: 74.56,12.73 74.22,13.06 arc(73.7,13.42) 73.07,13.54 71.17,13.54 arc(70.2,13.94) 69.8,14.91 69.8,17.14 arc(69.64,17.54) 69.23,17.71 61.53,17.71 arc(61.11,17.79) 60.76,18.03 60.07,18.71 arc(59.31,19.22) 58.42,19.4 ; U10.3 45.56,19.79 arc(45.67,19.51) 45.95,19.4 58.42,19.4 ; 58.42,19.4 58.65,19.4
  Top Layer w0.508: 74.73,12.6 74.77,12.65 R13.2
LI3: length 71.9
  Top Layer w0.381: 74.43,8.91 74.43,9.27 arc(74.29,9.61) v1(73.94,9.75) ; v1(21.82,23.29) 19.74,23.29 arc(19.28,23.1) 19.09,22.64 19.09,21.58 arc(19.08,21.56) 19.06,21.55
  Top Layer w0.508: 76.68,8.97 76.58,9.07 R23.2
  Bottom Layer w0.254: 21.82,23.29 arc(21.82,23.28) 21.82,23.28 71.27,23.28 arc(72.57,22.75) 73.1,21.45 73.1,10.59 arc(73.35,10) v1(73.94,9.75)
LO1: length 12
  Top Layer w0.61: 75.39,25.86 75.39,25.88 arc(75.6,26.39) 76.1,26.59 ; 80.67,32.36 80.66,32.35 R8.1 80.66,27.96 arc(80.26,26.99) 79.3,26.59 76.1,26.59 ; 76.1,26.59 arc(75.6,26.8) 75.39,27.31
LO2: length 11.9
  Top Layer w0.61: 51.89,30.15 51.87,30.13 51.87,27.89 arc(51.48,26.94) 50.53,26.54 47.55,26.54 arc(47.05,26.75) 46.84,27.26 ; 51.89,30.15 R32.1 ; 51.89,30.15 51.89,32.28 51.97,32.36 ; 51.89,30.15 51.89,30.15 ; 47.55,26.54 arc(47.03,26.33) 46.81,25.81
LO3: length 9.5
  Top Layer w0.61: 22.99,32.29 22.98,32.28 R42.1 22.98,27.54 arc(22.69,26.83) 21.98,26.54 21.11,26.54 arc(21.11,26.54) 21.11,26.54 arc(20.59,26.33) 20.37,25.81 ; 21.08,26.54 arc(20.58,26.75) 20.37,27.26
OUT1: length 35
  Top Layer w0.203: R45.2 84.52,47.28 arc(84.5,47.22) 84.44,47.2
  Top Layer w0.762: 74.45,39.5 74.45,34.91 ; 74.45,39.5 74.45,39.65 ; 74.45,39.5 arc(75.01,40.86) 76.38,41.43 ; 74.45,34.91 74.45,33.79 ; 74.45,34.91 arc(74.43,34.9) 74.41,34.89 73.35,34.89 ; 74.45,33.79 74.45,30.31 arc(74.29,29.53) 73.85,28.87 ; 74.45,33.79 arc(74.13,34.57) 73.35,34.89 ; R6.1 73.35,34.89 ; 73.35,34.89 arc(74.13,35.22) 74.45,36 ; 74.45,39.65 74.45,43.61 73.05,45.01 ; 74.45,39.65 arc(74.2,40.91) 73.48,41.99 ; 74.12,29.31 74.12,26.6
OUT2: length 36.3
  Top Layer w0.203: 56.14,48.39 56.17,48.42 R47.2
  Top Layer w0.762: 45.7,35.24 45.7,37.67 ; 45.7,35.24 45.7,35.22 ; 45.7,35.24 arc(45.66,35.06) 45.56,34.91 ; 45.7,37.67 45.7,39.22 ; 45.7,37.67 arc(45.46,36.48) 44.8,35.48 ; 45.7,39.22 45.7,39.86 ; 45.7,39.22 arc(46.31,40.69) 47.78,41.3 ; 45.7,39.86 45.7,43.61 44.27,45.04 ; 45.7,39.86 arc(45.5,40.82) 44.96,41.64 ; U10.6 45.56,34.91 ; 45.56,34.91 45.14,35.33 arc(44.98,35.43) 44.8,35.48 ; 44.77,34.89 44.48,35.18 ; 44.48,35.18 44.78,35.48 ; 44.48,35.18 R31.1 ; 45.05,34.49 45.05,34.82 arc(44.98,35.17) 44.79,35.46 ; 44.78,35.48 arc(44.78,35.47) 44.79,35.46 ; 44.78,35.48 arc(44.79,35.48) 44.8,35.48 ; 45.55,32.68 arc(45.37,33.89) 44.7,34.91 ; 44.8,35.48 arc(44.8,35.47) 44.79,35.46 ; 44.79,35.46 arc(44.78,35.46) 44.78,35.45
OUT3: length 37.6
  Top Layer w0.203: 27.61,48.74 27.62,48.75 R49.2
  Top Layer w0.254: 26.85,48.58 arc(26.85,48.57) 26.85,48.57
  Top Layer w0.61: 18.16,34.31 18.16,33.89 ; 18.16,34.31 arc(18.06,35.01) 17.82,35.68 ; 18.16,34.31 arc(18.16,34.1) 18.16,33.89 ; 18.16,33.89 18.16,29.28 arc(18.27,29.02) 18.52,28.91 ; 17.22,36.62 arc(17.09,37.09) 17.04,37.56 ; 17.22,36.62 arc(17.32,36.39) 17.44,36.16 ; 17.22,36.62 arc(17.13,36.72) 17.04,36.81 ; 17.22,36.62 arc(17.39,36.41) 17.55,36.17 ; 17.44,36.16 arc(17.34,36.15) 17.25,36.13 arc(16.78,35.95) 16.36,35.66 arc(17.09,35.68) 17.82,35.68 ; 17.44,36.16 arc(17.62,35.91) 17.82,35.68 ; 17.44,36.16 arc(17.5,36.17) 17.55,36.17 ; 17.82,35.68 arc(17.7,35.93) 17.55,36.17
  Top Layer w0.762: 19.13,25.88 19.13,26.54 arc(18.92,27.9) 18.3,29.13 ; 19,41.12 18.95,41.12 arc(17.6,40.57) 17.04,39.22 ; 17.04,39.22 17.04,39.78 ; 17.04,39.22 17.04,37.31 ; 17.04,39.78 17.04,43.51 15.65,44.91 ; 17.04,39.78 arc(16.82,40.88) 16.2,41.82 ; 15.58,34.88 16.36,35.66 arc(16.87,36.42) 17.04,37.31 ; 17.04,37.31 17.04,36.81
PWM1: length 9
  Top Layer w0.381: 82.85,20.24 81.39,20.24 arc(80.85,20.17) 80.35,19.97 ; 80.35,19.97 arc(80.82,20.31) 81.29,20.63 ; 80.35,19.97 arc(80.14,19.81) 79.93,19.64 ; 80.35,19.97 arc(80.13,19.82) 79.93,19.64 ; R7.1 arc(78.99,18.85) 79.93,19.64 ; 79.38,19.19 arc(78.69,18.63) 77.9,18.21
PWM2: length 7
  Top Layer w0.381: 80.41,16.84 80.42,16.85 arc(80.94,17.2) 81.56,17.32 ; 80.41,16.84 arc(80.73,17.19) 81.05,17.54 ; 80.41,16.84 arc(79.27,15.63) R12.1 ; 79.13,15.48 arc(78.57,15.01) 77.93,14.64
PWM3: length 8.5
  Top Layer w0.381: 80.14,13.29 80.79,13.94 arc(81.31,14.29) 81.93,14.41 ; 80.14,13.29 arc(79.17,12.03) R14.1 ; 80.14,13.29 arc(80.57,13.94) 80.98,14.6 ; 79.16,12.02 arc(78.56,11.5) 77.9,11.07
$1N26897: length 2
  Top Layer w0.203: LED2.1 79.4,23.19 arc(79.58,24.11) 80.1,24.89
$1N47865: length 5.3
  Top Layer w0.203: 45.98,17.86 46.36,17.86 ; 45.98,17.86 45.95,17.84 45.95,17.45 ; 45.98,17.86 45.54,17.86 ; 46.36,17.86 46.94,17.86 46.99,17.81 ; 46.36,17.86 arc(46.07,17.74) 45.95,17.45 ; 45.95,17.45 45.95,17.44 ; 45.95,17.44 U2.3 ; 45.95,17.44 arc(45.83,17.73) 45.54,17.86 ; R30.2 45.54,17.86
$1N69500: length 2
  Top Layer w0.203: 86.35,51.67 86.35,50.1 arc(86.43,49.91) LED5.1
$1N69943: length 2.2
  Top Layer w0.203: 57.96,51.94 57.96,50.1 LED6.1
$1N70111: length 2.6
  Top Layer w0.203: R49.1 29.41,51.99 29.41,49.79
$1N120688: length 2.4
  Top Layer w0.203: R44.1 75.79,6.49 arc(75.8,6.49) 75.81,6.5
$2N2292: length 2.6
  Top Layer w0.61: 76.81,31.12 77.76,30.18 79.05,30.18
$2N2294: length 2.2
  Top Layer w0.762: 86.59,42.52 86.59,40.43 arc(86.57,40.37) R18.2
$2N2295: length 2.3
  Top Layer w0.61: D1.1 71.31,31.11 71.32,31.12
$2N2297: length 2.2
  Top Layer w0.762: R2.1 69.76,50.83 arc(69.8,50.85) 69.83,50.9
$2N2308: length 8.7
  Top Layer w0.61: 79.1,34.47 79.16,34.41 79.16,33.4 ; 79.16,33.4 R9.2 ; 79.16,33.4 arc(78.83,34.19) 78.03,34.52 ; 79.05,34.55 79.02,34.52 78.03,34.52 ; 76.81,34.52 78.03,34.52 ; 75.9,36.81 75.9,36.35 arc(76.1,35.35) D6.2
$2N2309: length 18.9
  Top Layer w0.61: D1.2 69.34,34.8 69.83,34.8 ; 71.34,34.8 71.35,34.8 ; 71.34,34.8 71.34,34.84 ; 71.34,34.8 70.04,34.8 ; 71.34,34.8 71.34,33.5 ; 71.34,34.84 71.35,34.82 ; 71.34,34.84 71.26,34.92 ; 69.83,34.8 70.04,34.8 ; 69.83,34.8 arc(70.46,35.25) 70.7,35.98 ; 69.83,34.8 arc(69.64,34.75) 69.45,34.74 ; 70.04,34.8 arc(70.96,34.42) 71.34,33.5 ; 70.71,37.94 70.71,39.24 71.58,40.11 ; 70.71,37.94 arc(70.7,37.92) 70.7,37.9 70.7,36.52 ; 70.71,37.94 arc(71.33,39.43) 72.82,40.05 ; 70.7,36.52 70.7,34.94 ; 70.7,36.52 arc(70.86,35.69) 71.33,34.99 ; R4.2 71.34,33.5
$2N2310: length 5
  Top Layer w1.016: 64.49,27.44 64.49,27.66 ; 67.53,23.95 arc(65.38,24.84) 64.49,26.99
$2N2312: length 2.6
  Top Layer w0.61: D11.1 48.91,30.25 50.32,30.25
$2N2314: length 2.2
  Top Layer w0.762: R36.2 58.07,43.97 arc(58.06,43.99) 58.04,43.99
$2N2315: length 2.3
  Top Layer w0.61: 42.7,31.07 42.68,31.08 D8.1
$2N2317: length 2.4
  Top Layer w0.762: R24.1 41.31,50.73 arc(41.39,50.77) 41.43,50.85
$2N2328: length 6.7
  Top Layer w0.61: R33.2 50.34,32.3 ; 50.36,32.3 R34.2 ; 47.37,36.67 47.37,36.22 arc(47.56,35.27) D11.2 50.21,34.47 50.24,34.44
$2N2329: length 18.5
  Top Layer w0.61: 42.69,34.65 42.69,34.79 42.72,34.83 ; 42.69,34.65 42.69,33.71 ; 42.69,34.65 42.17,35.17 42.17,35.94 ; 42.69,34.65 arc(42.31,35.25) 42.17,35.94 ; 42.69,34.65 arc(42.7,34.64) 42.72,34.62 ; 42.93,40.13 42.17,39.38 42.17,37.82 ; 42.69,33.71 R28.2 ; 42.69,33.71 arc(42.38,34.46) 41.62,34.77 ; D8.2 40.69,34.77 41.62,34.77 ; 42.17,37.82 42.17,36.1 ; 42.17,37.82 arc(42.85,39.46) 44.48,40.13 44.68,40.13 ; 42.17,36.1 42.17,35.94 ; 42.17,36.1 arc(42.03,35.38) 41.62,34.77 ; 41.62,34.77 42.52,34.77
$2N2330: length 5
  Top Layer w1.016: D10.2 36.09,27 arc(37,24.81) 39.19,23.9
$2N2332: length 2.6
  Top Layer w0.61: 21.31,30.15 20.05,30.15 D16.1
$2N2334: length 2.2
  Top Layer w0.762: 29.54,43.64 29.52,43.64 R48.2
$2N2335: length 2.5
  Top Layer w0.61: 14.12,31.09 14.11,31.08 D13.1
$2N2337: length 2.3
  Top Layer w0.762: R38.1 12.57,50.63 12.57,50.6
$2N2348: length 13.9
  Top Layer w0.508: Q6.1 18.82,36.43 arc(18.84,36.11) 18.89,35.79 arc(19.18,35.02) 19.68,34.37
  Top Layer w0.61: 20.01,34.37 19.23,34.37 D16.2 ; 20.01,34.37 20.32,34.37 ; 20.01,34.37 arc(19.76,34.32) 19.56,34.18 ; 21.44,34.39 21.44,34.47 21.47,34.44 21.47,33.22 ; 20.32,34.37 21.31,34.37 ; 20.32,34.37 arc(21.14,34.03) 21.47,33.22 ; 20.32,34.37 arc(19.84,34.46) 19.44,34.73 19.41,34.77 ; R43.2 21.47,33.22 ; 18.95,34.52 18.89,35.79 Q6.1
$2N2349: length 18.5
  Top Layer w0.61: D13.2 11.88,34.77 12.75,34.77 ; 14.17,40.13 13.29,39.24 13.29,37.91 ; 14.07,33.76 R39.2 ; 14.07,33.76 14.07,34.66 ; 14.07,33.76 arc(13.78,34.48) 13.06,34.77 ; 13.06,34.77 13.77,34.77 ; 13.06,34.77 12.75,34.77 ; 13.06,34.77 arc(13.22,34.84) 13.29,35 13.29,35.5 ; 13.77,34.77 13.92,34.77 ; 13.77,34.77 arc(13.92,34.7) 14.07,34.66 ; 13.77,34.77 arc(13.44,35.08) 13.29,35.5 ; 13.29,37.91 13.29,35.55 ; 13.29,37.91 arc(13.94,39.48) 15.51,40.13 15.81,40.13 ; 13.29,35.5 13.29,35.55 ; 13.29,35.5 arc(13.28,35.51) 13.28,35.53 ; R41.2 14.07,34.66 ; 12.75,34.77 arc(12.53,34.69) 12.3,34.67 ; 12.75,34.77 arc(13.11,35.08) 13.28,35.53 ; 13.29,35.55 arc(13.28,35.53) 13.28,35.53 ; 13.29,35.55 arc(13.29,35.6) 13.29,35.66 ; 13.28,35.53 arc(13.28,35.58) 13.28,35.63
$2N2350: length 4.9
  Top Layer w1.016: D15.2 9.79,26.92 arc(10.67,24.78) 12.8,23.9

## Copper pours and planes (outline as drawn; the poured copper is in the pictures)
GND on Top Layer: -7.69,42.76 -7.67,42.95 -7.61,43.17 -7.52,43.38 -7.39,43.57 -7.23,43.73 -7.04,43.86 -6.84,43.95 -6.61,44.01 -6.42,44.03 91.1,44.03 91.3,44.01 91.52,43.95 91.73,43.86 91.91,43.73 92.08,43.57 92.21,43.38 92.3,43.17 92.36,42.95 92.37,42.76 92.37,0.77 92.36,0.57 92.3,0.35 92.21,0.14 92.08,-0.05 91.91,-0.21 91.73,-0.34 91.52,-0.43 91.3,-0.49 91.1,-0.5 -6.42,-0.5 -6.61,-0.49 -6.84,-0.43 -7.04,-0.34 -7.23,-0.21 -7.39,-0.05 -7.52,0.14 -7.61,0.35 -7.67,0.57 -7.69,0.77
GND on Top Layer: 29.48,7.17 31.01,7.17 31.01,3.75 29.48,3.75
GND on Top Layer: -10.1,51.01 -10.09,51.27 -10.04,51.61 -9.94,51.95 -9.82,52.27 -9.65,52.58 -9.45,52.87 -9.22,53.13 -8.96,53.36 -8.67,53.56 -8.36,53.73 -8.04,53.85 -7.7,53.94 -7.36,54 -7.1,54.01 84.89,54.01 85.15,54 85.49,53.94 85.83,53.85 86.15,53.73 86.46,53.56 86.75,53.36 87.01,53.13 87.24,52.87 87.44,52.58 87.61,52.27 87.73,51.95 87.83,51.61 87.88,51.27 87.89,51.01 87.89,37.95 87.88,37.69 87.83,37.34 87.73,37 87.61,36.68 87.44,36.37 87.24,36.09 87.01,35.83 86.75,35.59 86.46,35.39 86.15,35.23 85.83,35.1 85.49,35.01 85.15,34.96 84.89,34.95 -7.1,34.95 -7.36,34.96 -7.7,35.01 -8.04,35.1 -8.36,35.23 -8.67,35.39 -8.96,35.59 -9.22,35.83 -9.45,36.09 -9.65,36.37 -9.82,36.68 -9.94,37 -10.04,37.34 -10.09,37.69 -10.1,37.95
GND on Bottom Layer: -5.05,68.87 90.52,68.87 90.52,-6.22 -5.05,-6.22
VCC on Top Layer: 52.27,15.8 54.69,15.8 54.69,3.76 52.27,3.76
BAT on Top Layer: 7.2,51.06 10.28,51.06 10.28,47.32 7.2,47.32
BAT on Top Layer: -6.14,61.8 -6.13,62.06 -6.08,62.41 -5.99,62.75 -5.86,63.07 -5.69,63.38 -5.49,63.66 -5.26,63.92 -5,64.16 -4.71,64.36 -4.41,64.52 -4.08,64.65 -3.75,64.74 -3.4,64.79 -3.14,64.8 66.32,64.8 66.58,64.79 66.93,64.74 67.26,64.65 67.59,64.52 67.9,64.36 68.18,64.16 68.44,63.92 68.67,63.66 68.87,63.38 69.04,63.07 69.17,62.75 69.26,62.41 69.31,62.06 69.32,61.8 69.32,46.52 69.31,46.26 69.26,45.91 69.17,45.57 69.04,45.25 68.87,44.94 68.67,44.66 68.44,44.4 68.18,44.16 67.9,43.96 67.59,43.8 67.26,43.67 66.93,43.58 66.58,43.53 66.32,43.52 -3.14,43.52 -3.4,43.53 -3.75,43.58 -4.08,43.67 -4.41,43.8 -4.71,43.96 -5,44.16 -5.26,44.4 -5.49,44.66 -5.69,44.94 -5.86,45.25 -5.99,45.57 -6.08,45.91 -6.13,46.26 -6.14,46.52
BAT on Top Layer: 35.98,51.19 39.05,51.19 39.05,47.44 35.98,47.44
BAT on Top Layer: 64.56,51.26 67.63,51.26 67.63,47.52 64.56,47.52
BOOT on Top Layer: 33.45,16.26 41.25,16.26 41.25,13.21 33.45,13.21
OUT1 on Top Layer: 71.22,52.06 79.91,52.06 79.91,40.92 71.22,40.92
OUT1 on Top Layer: 83.25,45.61 86.99,45.61 86.99,42.53 83.25,42.53
OUT2 on Top Layer: 42.37,51.65 53.01,51.65 53.01,40.93 42.37,40.93
OUT2 on Top Layer: 54.72,47.03 58.47,47.03 58.47,43.96 54.72,43.96
OUT3 on Top Layer: 13.69,51.67 25.76,51.67 25.76,40.92 13.69,40.92
OUT3 on Top Layer: 26.27,46.66 30.01,46.66 30.01,43.59 26.27,43.59
$1N55018 on Top Layer: 37.7,10.29 43.51,10.29 43.51,4.22 37.7,4.22
$1N57788 on Top Layer: 42.25,11.43 47.32,11.43 47.32,3.15 42.25,3.15
$2N2311 on Top Layer: 69.34,29.73 71.93,29.73 71.93,25.54 69.34,25.54
$2N2331 on Top Layer: 40.84,29.68 43.44,29.68 43.44,25.44 40.84,25.44
$2N2351 on Top Layer: 14.43,29.67 16.87,29.67 16.87,25.48 14.43,25.48

Small or netless copper shapes (teardrops, artwork), in the pictures only: 194 on Top Layer, 5 on Bottom Layer

## Text on the board
Document Layer: 信号 | 电 | 地
Top Silkscreen Layer: 1.2k | 47uH | 4.7u | 1 | 2 | 3 | BOOT | Vcc | C | B | A | 負極 | 正極 | 关
